# Altium project DIO_MCX_Isolated_mezzanine.PrjPCB
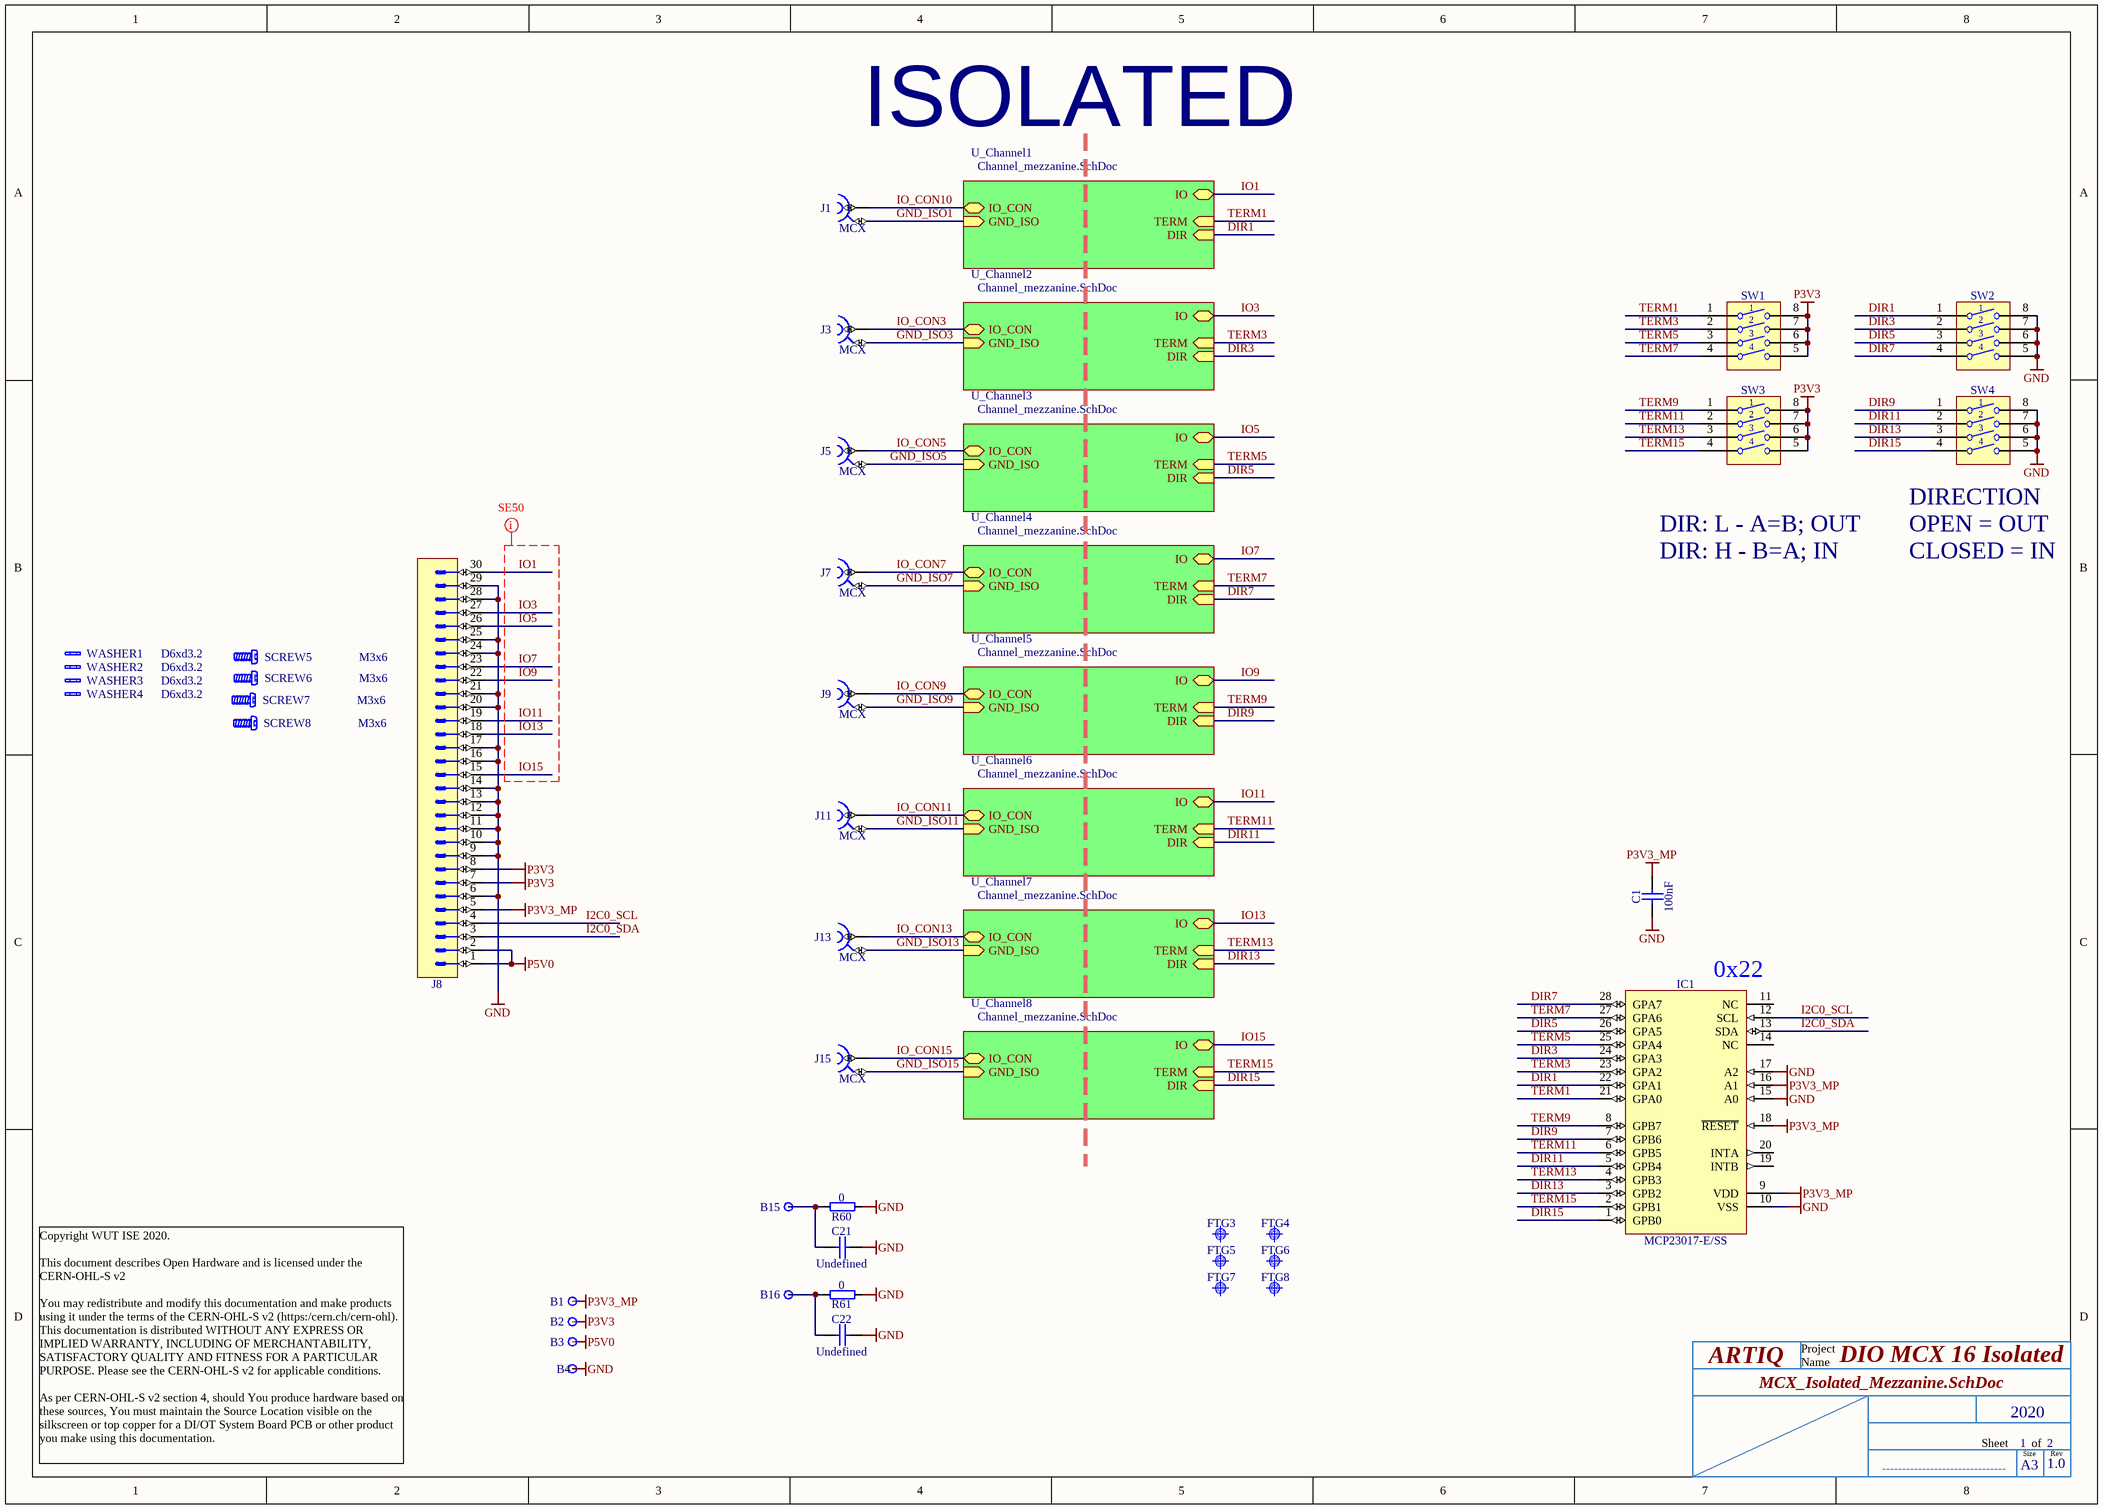
[diagram p0: MCX_Isolated_Mezzanine.SchDoc]
2 sheets, 239 parts. Net scope: hierarchical (ports join the sheet entries above them; power ports are global).
Board file: DIO_MCX_Isolated_mezzanine.PCBDOC
Sheets:
  MCX_Isolated_Mezzanine.SchDoc
    U_Channel1 = Channel_mezzanine.SchDoc
    U_Channel2 = Channel_mezzanine.SchDoc
    U_Channel3 = Channel_mezzanine.SchDoc
    U_Channel4 = Channel_mezzanine.SchDoc
    U_Channel5 = Channel_mezzanine.SchDoc
    U_Channel6 = Channel_mezzanine.SchDoc
    U_Channel7 = Channel_mezzanine.SchDoc
    U_Channel8 = Channel_mezzanine.SchDoc

## Sheet MCX_Isolated_Mezzanine.SchDoc: DIO MCX 16 Isolated
size A3; Author: F.Świtakowski; CompanyName: WUT ISE; DrawnBy: F.Świtakowski; Organization: WUT ISE; Address1: PW ISE; Address2: Nowowiejska 15/19 00-665 Warsaw; DocumentNumber: 1; Revision: 2; SheetNumber: 1; SheetTotal: 2; ModifiedBy: -; CheckedDate: -; Title2: Mezzanine; DivGrp: WUT ISE; Designer: F.Świtakowski; ModifiedDate: -; ProjectName: Sensor Box

### Parts
B1  Plated Hole  [c130h60]  (value not drawn)
B2  Plated Hole  [c130h60]  (value not drawn)
B3  Plated Hole  [c130h60]  (value not drawn)
B4  Plated Hole  [c130h60]  (value not drawn)
B15  Plated Hole  [MTG270_500]  (value not drawn)
B16  Plated Hole  [MTG270_500]  (value not drawn)
C1  100nF  [CAPC1005X55N]
C21  Undefined  [CAPC2012X135N]
C22  Undefined  [CAPC2012X135N]
FTG3  Use only in PCB  [FIDUCIAL_TOP_S100-200]  (value not drawn)
FTG4  Use only in PCB  [FIDUCIAL_TOP_C100-200]  (value not drawn)
FTG5  Use only in PCB  [FIDUCIAL_TOP_S100-200]  (value not drawn)
FTG6  Use only in PCB  [FIDUCIAL_TOP_C100-200]  (value not drawn)
FTG7  Use only in PCB  [FIDUCIAL_TOP_C100-200]  (value not drawn)
FTG8  Use only in PCB  [FIDUCIAL_TOP_S100-200]  (value not drawn)
IC1  MCP23017-E/SS  [SOP65P780X200-28N]
J1  MCX  [BEL_133-3701-801]
J3  MCX  [BEL_133-3701-801]
J5  MCX  [BEL_133-3701-801]
J7  MCX  [BEL_133-3701-801]
J8  AMPMODU  [TYCO_1-215307-5]  (value not drawn)
J9  MCX  [BEL_133-3701-801]
J11  MCX  [BEL_133-3701-801]
J13  MCX  [BEL_133-3701-801]
J15  MCX  [BEL_133-3701-801]
R60  0  [RESC1608X55N]
R61  0  [RESC1608X55N]
SCREW5  M3x6  [BOSSARD_BN5687-3061605_v]
SCREW6  M3x6  [BOSSARD_BN5687-3061605_v]
SCREW7  M3x6  [BOSSARD_BN5687-3061605_v]
SCREW8  M3x6  [BOSSARD_BN5687-3061605_v]
SW1  Switch  [SW_OMRON_A6S-4102-H]  (value not drawn)
SW2  Switch  [SW_OMRON_A6S-4102-H]  (value not drawn)
SW3  Switch  [SW_OMRON_A6S-4102-H]  (value not drawn)
SW4  Switch  [SW_OMRON_A6S-4102-H]  (value not drawn)
WASHER1  D6xd3.2  [BOSSARD_B3/6/0.3/BN1976_v]
WASHER2  D6xd3.2  [BOSSARD_B3/6/0.3/BN1976_v]
WASHER3  D6xd3.2  [BOSSARD_B3/6/0.3/BN1976_v]
WASHER4  D6xd3.2  [BOSSARD_B3/6/0.3/BN1976_v]

### Sub-sheets
U_Channel1 = Channel_mezzanine.SchDoc: IO (bidir), TERM (in), DIR (in), IO_CON (bidir), GND_ISO (in)
U_Channel2 = Channel_mezzanine.SchDoc: IO (bidir), TERM (in), DIR (in), IO_CON (bidir), GND_ISO (in)
U_Channel3 = Channel_mezzanine.SchDoc: IO (bidir), TERM (in), DIR (in), IO_CON (bidir), GND_ISO (in)
U_Channel4 = Channel_mezzanine.SchDoc: IO (bidir), TERM (in), DIR (in), IO_CON (bidir), GND_ISO (in)
U_Channel5 = Channel_mezzanine.SchDoc: IO (bidir), TERM (in), DIR (in), IO_CON (bidir), GND_ISO (in)
U_Channel6 = Channel_mezzanine.SchDoc: IO (bidir), TERM (in), DIR (in), IO_CON (bidir), GND_ISO (in)
U_Channel7 = Channel_mezzanine.SchDoc: IO (bidir), TERM (in), DIR (in), IO_CON (bidir), GND_ISO (in)
U_Channel8 = Channel_mezzanine.SchDoc: IO (bidir), TERM (in), DIR (in), IO_CON (bidir), GND_ISO (in)

### Nets
GND: B4.1 C1.1 C21.2 C22.2 IC1.10(VSS) IC1.15(A0) IC1.17(A2) J8.6 J8.9 J8.10 J8.11 J8.12 J8.13 J8.14 J8.16 J8.17 J8.20 J8.21 J8.24 J8.25 J8.28 J8.29 R60.1 R61.1 SW2.5 SW2.6 SW2.7 SW2.8 SW4.5 SW4.6 SW4.7 SW4.8
P3V3: B2.1 J8.7 J8.8 SW1.5 SW1.6 SW1.7 SW1.8 SW3.5 SW3.6 SW3.7 SW3.8
P3V3_MP: B1.1 C1.2 IC1.9(VDD) IC1.16(A1) IC1.18(~{RESET}) J8.5
P5V0: B3.1 J8.1 J8.2
DIR1: IC1.22(GPA1) SW2.1 ; sheet U_Channel1/DIR  [project net DIR]
DIR3: IC1.24(GPA3) SW2.2 ; sheet U_Channel2/DIR  [project net DIR]
DIR5: IC1.26(GPA5) SW2.3 ; sheet U_Channel3/DIR  [project net DIR]
DIR7: IC1.28(GPA7) SW2.4 ; sheet U_Channel4/DIR  [project net DIR]
DIR9: IC1.7(GPB6) SW4.1 ; sheet U_Channel5/DIR  [project net DIR]
DIR11: IC1.5(GPB4) SW4.2 ; sheet U_Channel6/DIR  [project net DIR]
DIR13: IC1.3(GPB2) SW4.3 ; sheet U_Channel7/DIR  [project net DIR]
DIR15: IC1.1(GPB0) SW4.4 ; sheet U_Channel8/DIR  [project net DIR]
GND_ISO1: J1.2 ; sheet U_Channel1/GND_ISO  [project net GND_ISO]
GND_ISO3: J3.2 ; sheet U_Channel2/GND_ISO  [project net GND_ISO]
GND_ISO5: J5.2 ; sheet U_Channel3/GND_ISO  [project net GND_ISO]
GND_ISO7: J7.2 ; sheet U_Channel4/GND_ISO  [project net GND_ISO]
GND_ISO9: J9.2 ; sheet U_Channel5/GND_ISO  [project net GND_ISO]
GND_ISO11: J11.2 ; sheet U_Channel6/GND_ISO  [project net GND_ISO]
GND_ISO13: J13.2 ; sheet U_Channel7/GND_ISO  [project net GND_ISO]
GND_ISO15: J15.2 ; sheet U_Channel8/GND_ISO  [project net GND_ISO]
I2C0_SCL: IC1.12(SCL) J8.4
I2C0_SDA: IC1.13(SDA) J8.3
IO1: J8.30 ; sheet U_Channel1/IO  [project net IO]
IO3: J8.27 ; sheet U_Channel2/IO  [project net IO]
IO5: J8.26 ; sheet U_Channel3/IO  [project net IO]
IO7: J8.23 ; sheet U_Channel4/IO  [project net IO]
IO9: J8.22 ; sheet U_Channel5/IO  [project net IO]
IO11: J8.19 ; sheet U_Channel6/IO  [project net IO]
IO13: J8.18 ; sheet U_Channel7/IO  [project net IO]
IO15: J8.15 ; sheet U_Channel8/IO  [project net IO]
IO_CON3: J3.1 ; sheet U_Channel2/IO_CON  [project net IO_CON]
IO_CON5: J5.1 ; sheet U_Channel3/IO_CON  [project net IO_CON]
IO_CON7: J7.1 ; sheet U_Channel4/IO_CON  [project net IO_CON]
IO_CON9: J9.1 ; sheet U_Channel5/IO_CON  [project net IO_CON]
IO_CON10: J1.1 ; sheet U_Channel1/IO_CON  [project net IO_CON]
IO_CON11: J11.1 ; sheet U_Channel6/IO_CON  [project net IO_CON]
IO_CON13: J13.1 ; sheet U_Channel7/IO_CON  [project net IO_CON]
IO_CON15: J15.1 ; sheet U_Channel8/IO_CON  [project net IO_CON]
TERM1: IC1.21(GPA0) SW1.1 ; sheet U_Channel1/TERM  [project net TERM]
TERM3: IC1.23(GPA2) SW1.2 ; sheet U_Channel2/TERM  [project net TERM]
TERM5: IC1.25(GPA4) SW1.3 ; sheet U_Channel3/TERM  [project net TERM]
TERM7: IC1.27(GPA6) SW1.4 ; sheet U_Channel4/TERM  [project net TERM]
TERM9: IC1.8(GPB7) SW3.1 ; sheet U_Channel5/TERM  [project net TERM]
TERM11: IC1.6(GPB5) SW3.2 ; sheet U_Channel6/TERM  [project net TERM]
TERM13: IC1.4(GPB3) SW3.3 ; sheet U_Channel7/TERM  [project net TERM]
TERM15: IC1.2(GPB1) SW3.4 ; sheet U_Channel8/TERM  [project net TERM]
NetB15_1: B15.1 C21.1 R60.2
NetB16_1: B16.1 C22.1 R61.2

Not connected (* = marked no-connect by the designer): IC1 11(NC) 14(NC) 19(INTB) 20(INTA)

### Layout directives
net class SE50; rule Width Constraint [Pref Width = 0.35mm    Min Width = 0.3mm    Max Width = 0.35mm]: IO1, IO3, IO5, IO7, IO9, IO11, IO13, IO15

### Notes on the sheet
- ISOLATED
- (near SW4) DIRECTION
- DIR: L - A=B; OUT
- DIR: H - B=A; IN
- OPEN = OUT
- CLOSED = IN
- (near IC1) 0x22
- ARTIQ
- Project
- Name
- Copyright WUT ISE 2020.
  This document describes Open Hardware and is licensed under the CERN-OHL-S v2
  You may redistribute and modify this documentation and make products using it under the terms of the CERN-OHL-S v2 (https:/cern.ch/cern-ohl). This documentation is distributed WITHOUT ANY EXPRESS OR IMPLIED WARRANTY, INCLUDING OF MERCHANTABILITY, SATISFACTORY QUALITY AND FITNESS FOR A PARTICULAR PURPOSE. Please see the CERN-OHL-S v2 for applicable conditions.
  As per CERN-OHL-S v2 section 4, should You produce hardware based on these sources, You must maintain the Source Location visible on the silkscreen or top copper for a DI/OT System Board PCB or other product you make using this documentation.
- Sheet
- 2020
- Size
- A3
- of
- Rev
- -------------------------------
- 1.0

### Library data of the parts
B1-B4 = PLATED_HOLE0.6_PAD1.3: Single Terminal Socket; Part Description: Plated Through Hole: Hole Dia.=0.6mm Pad Dia.=1.3mm; Mounted: No; Part Number: PLATED_HOLE0.6_PAD1.3; Component Kind: Standard (No BOM); Component Type: Standard (No BOM); Pin Count: 1; Family: Plated Hole; Socket: No; SMD: No; Sense: No; Status: None; ComponentHeight: 0mm; HelpURL: Undefined; Author: CERN DEM MR; CreateDate: 02.03.2016; LatestRevisionDate: 02.03.2016; PackageDescription: Plated Through Hole: Hole Dia.=0.6mm Pad Dia.=1.3mm
B15 B16 = PLATED_HOLE2.7_PAD5.0: Single Terminal Socket; Part Description: Plated Through Hole: Hole Dia.=2.7mm Pad Dia.=5.0mm; Mounted: No; Part Number: PLATED_HOLE2.7_PAD5.0; Component Kind: Standard (No BOM); Component Type: Standard (No BOM); Pin Count: 1; Family: Plated Hole; Socket: No; SMD: No; Sense: No; Status: None; ComponentHeight: 0mm; HelpURL: Undefined; Author: CERN DEM JMW; CreateDate: 27.09.2011; LatestRevisionDate: 27.09.2011; PackageDescription: Plated Through Hole: Hole Dia.=2.7mm Pad Dia.=5.0mm
C1 = CC0402_100NF_50V_10%_X7R: Non-polarised capacitor; Part Description: SMD Multilayer Chip Ceramic Capacitor; Manufacturer: GENERIC; Manufacturer1 Part Number: GRM155R71H104KE14D; Voltage: 50V; TC: X7R; Tolerance: ±10%; Part Number: CC0402_100NF_50V_10%_X7R; Component Kind: Standard; Component Type: Standard; Pin Count: 2; Value: 100nF; Status: None; Manufacturer Part Number: CC0402_100NF_50V_10%_X7R; Case: 0402; Mounted: Yes; Socket: No; SMD: Yes; Sense: No; Manufacturer1 Example: MURATA; Manufacturer1 ComponentHeight: 0.55mm; HelpURL: \\cern.ch\dfs\Applications\Altium\Datasheets\CC0402_MURATA_GRM155R71H104KE14D.pdf; Author: CERN DEM MR; CreateDate: 30.06.2017; LatestRevisionDate: 30.06.2017
C21 C22 = CC0805_NO-VALUE: Non-polarised capacitor; Part Description: Reserved Footprint For 0805(2012) Chip Ceramic Capacitor; Mounted: No; Part Number: CC0805_NO-VALUE; Component Kind: Standard; Component Type: Standard; Pin Count: 2; Value: Undefined; Status: None; Manufacturer: Undefined; Manufacturer Part Number: CC0805_NO-VALUE; Case: 0805; Socket: No; SMD: Yes; Sense: No; Manufacturer1 ComponentHeight: 1.35mm; HelpURL: Undefined; Author: CERN DEM JLC; CreateDate: 10.12.2008; LatestRevisionDate: 11.09.2013
FTG3 FTG5 FTG8 = FIDUCIAL_TARGET_S100-200: Fiducial Target; Part Description: Square Fiducial Target, Top Layer, 1.0mm, Top Solder 2.0mm, Keepout =2.0mm; Mounted: No; Part Number: FIDUCIAL_TARGET_S100-200; Component Kind: Standard (No BOM); Component Type: Standard (No BOM); Pin Count: 1; Family: Fiducial; Socket: No; SMD: Yes; Sense: No; Status: None; ComponentHeight: 0mm; HelpURL: Undefined; Author: CERN DEM JLC; CreateDate: 09.02.2010; LatestRevisionDate: 04.04.2012; PackageDescription: Square Fiducial Target, Top Layer, 1.0mm, Top Solder 2.0mm, Keepout =2.0mm
FTG4 FTG6 FTG7 = FIDUCIAL_TARGET_C100-200: Fiducial Target; Part Description: Round Fiducial Target, Top Layer, 1.0mm, Top Solder 2.0mm, Keepout =2.0mm; Mounted: No; Part Number: FIDUCIAL_TARGET_C100-200; Component Kind: Standard (No BOM); Component Type: Standard (No BOM); Pin Count: 1; Family: Fiducial; Socket: No; SMD: Yes; Sense: No; Status: None; ComponentHeight: 0mm; HelpURL: Undefined; Author: CERN DEM JLC; CreateDate: 09.02.2010; LatestRevisionDate: 04.04.2012; PackageDescription: Round Fiducial Target, Top Layer, 1.0mm, Top Solder 2.0mm, Keepout =2.0mm
IC1 = MCP23017-E/SS: 16-bit I/O Port Expander With Serial Interface; Manufacturer: MICROCHIP TECHNOLOGY; PressFit: No; Bonding: No; Part Number: MCP23017-E/SS; Component Kind: Standard; Component Type: Standard; Device: MCP23017-E/SS; PackageDescription: SOP, 0.65mm Pitch; 28 pin, 5.30mm W X 10.20mm L X 2.00mm H body, IPC Medium Density; Part Description: 16-bit I/O Port Expander With Serial Interface; Manufacturer Part Number: MCP23017-E/SS; Pin Count: 28; Case: SSOP28; Mounted: Yes; Socket: No; SMD: Yes; Sense: No; ComponentHeight: 2mm; Author: CERN DEM JLC; HelpURL: \\cern.ch\dfs\Applications\Altium\Datasheets\MCP23017-E-SS.pdf; CreateDate: 17/01/2011; LatestRevisionDate: 17/01/2011
J1 J3 J5 J7 J9 J11 J13 J15 = BELFUSE_133-3701-801: Part Description: MCX Jack, End Launch Straight Receptacle - Tab Contact, For 1.6mm Thickness Board; Manufacturer: BEL; PressFit: No; Part Number: BELFUSE_133-3701-801; Component Kind: Standard; Component Type: Standard; Pin Count: 2; Family: MCX; Mounted: Yes; Socket: No; SMD: No; Sense: No; Status: None; Manufacturer Part Number: 133-3701-801; ComponentHeight: 3.53mm; HelpURL: \\cern.ch\dfs\Applications\Altium\Datasheets\BEL_133-3701-801.pdf; Author: CERN DEM MR; CreateDate: 21.10.2019; LatestRevisionDate: 21.10.2019
J8 = CON_2x15_2.54_female_V_mirror: Connector 2.54mm, 30 pin female, vertical, 7mm, AMPMODU HV-100/HV-190; Part Description: 34 Contacts, Dual Row Vertical Low Profile IDC Shrouded Header, with Long Eject Latch; Manufacturer: TYCO ELECTRONICS; Manufacturer Part Number: 1-215307-5; PressFit: No; Part Number: TYCO_1-215307-5; Component Kind: Standard; Component Type: Standard; Pin Count: 30; Family: AMPMODU; Mounted: Yes; Socket: No; SMD: No; Sense: No; Status: None; ComponentHeight: 22.86mm; HelpURL: \\cern.ch\dfs\Applications\Altium\Datasheets\TYCO_3-1761606-1.pdf; Author: GK; CreateDate: 05.10.2015; LatestRevisionDate: 05.10.2015
R60 R61 = R0603_0R_JUMPER: Resistor; Part Description: 1A (0.05R Max DC Resistance) Zero Ohm Jumper; Manufacturer: GENERIC; Manufacturer1 Part Number: NRC06Z0; PressFit: No; Part Number: R0603_0R_JUMPER; Component Kind: Standard; Component Type: Standard; Pin Count: 2; Value: 0; Status: Preferred; Manufacturer Part Number: R0603_0R_JUMPER; Case: 0603; Mounted: Yes; Sense: No; Socket: No; SMD: Yes; Manufacturer1 Example: NIC COMPONENT; Manufacturer1 ComponentHeight: 0.55mm; HelpURL: \\cern.ch\dfs\Applications\Altium\Datasheets\R0603_NIC_NRC.pdf; Author: CERN DEM JLC; CreateDate: 03.12.2007; LatestRevisionDate: 13.03.2008
SCREW5-SCREW8 = BOSSARD_BN5687-3061605_v: Screw; Part Description: M3 L=6mm Hexalobular Socket Pan Head Screw, Fully Threaded, Stainless Steel A2; Manufacturer Part Number: BN5687 Art.3061605; PressFit: No; Part Number: BOSSARD_BN5687-3061605_v; Component Kind: Standard; Component Type: Mechanical; Pin Count: 0; PackageDescription: M3 L=6mm Hexalobular Socket Pan Head Screw, Fully Threaded - Stainless Steel A2; Mounted: Yes; Socket: No; SMD: No; Sense: No; Status: None; Value: M3x6; Manufacturer: BOSSARD; ComponentHeight: 2.4mm; HelpURL: \\cern.ch\dfs\Applications\Altium\Datasheets\BOSSARD_BN5687-3061605.pdf; Author: CERN DEM JLC; CreateDate: 15.01.2013; LatestRevisionDate: 15.01.2013
SW1-SW4 = SW_OMRON_A6S-4102-H: 4 Ways SPST DIP Switch; Part Description: 4 Ways SPST DIP Switch, White Flat Actuator with Seal Tape, Contact Rating 25mA 24VDC; Manufacturer: OMRON; PressFit: No; Part Number: SW_OMRON_A6S-4102-H; Component Kind: Standard; Component Type: Standard; Pin Count: 8; PackageDescription: Pitch 2.54mm, Body 11.3x6.4mm, 4 Ways SPST Surface-Mounting DIP Switch, OMRON A6S-H; Family: Switch; Mounted: Yes; Socket: No; SMD: Yes; Sense: No; Status: None; Manufacturer Part Number: A6S-4102-H; ComponentHeight: 3.8mm; HelpURL: \\cern.ch\dfs\Applications\Altium\Datasheets\SW_OMRON_A6S-4102-H.pdf; Author: CERN DEM JMW; CreateDate: 25.09.2008; LatestRevisionDate: 25.09.2008
WASHER1-WASHER4 = MECH_Washer_M3x0.3x6: Washer, M3x0.3x6; Part Number: BOSSARD_B3/6/0.3/BN1976; Part Description: Flat Washer without Chamfer for M3 Screw, Steel; Manufacturer: BOSSARD; Manufacturer Part Number: B3/6/0.3/BN1976; PressFit: No; Component Kind: Standard; Component Type: Mechanical; Pin Count: 0; PackageDescription: Flat Washer without Chamfer for M3 Screw, steel; Mounted: Yes; Socket: No; SMD: No; Sense: No; Status: None; Value: D6xd3.2; ComponentHeight: 0.5mm; HelpURL: \\cern.ch\dfs\Applications\Altium\Datasheets\BOSSARD_BN1074-1404830.pdf; Author: GK; CreateDate: 08.03.2018; LatestRevisionDate: 08.03.2018

## Sheet Channel_mezzanine.SchDoc: DIO MCX 16 Isolated
size A4; DocumentNumber: 2; SheetNumber: 2; SheetTotal: 2
Used 8 times, as channels U_Channel1, U_Channel2, U_Channel3, U_Channel4, U_Channel5, U_Channel6, U_Channel7, U_Channel8. Parts and nets are listed once, with the designators drawn on the sheet.
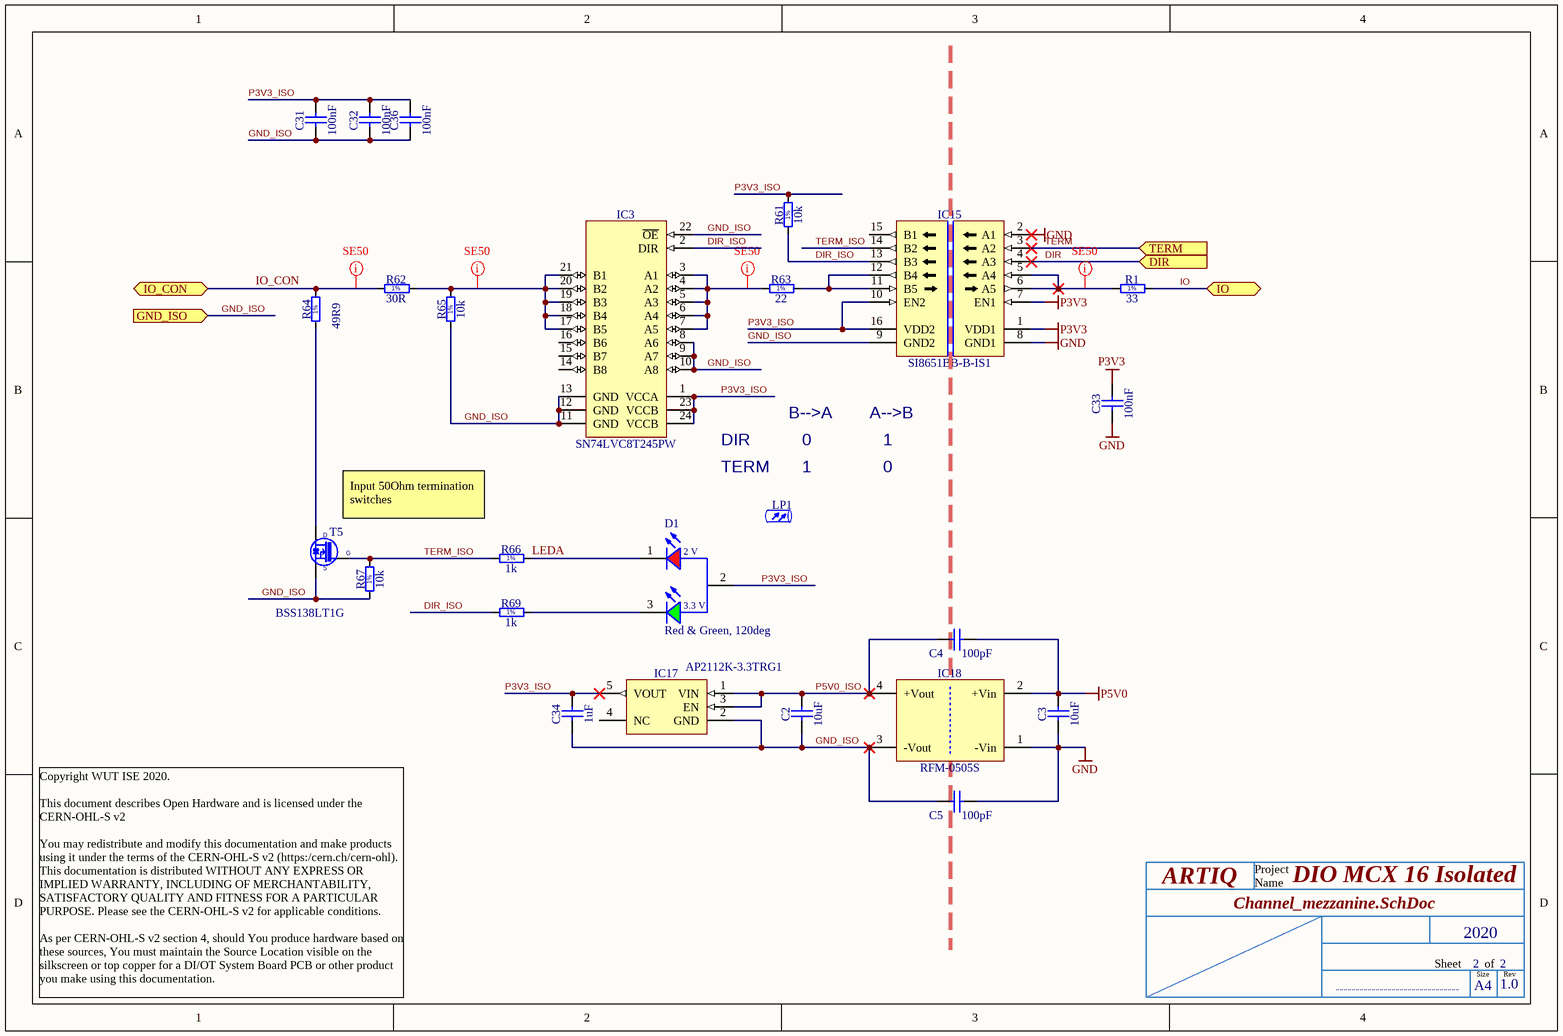
[diagram p1: Channel_mezzanine.SchDoc]

### Parts
C2  10uF  [CAPC1608X80N]
C3  10uF  [CAPC1608X80N]
C4  100pF  [CAPC3216X180N]
C5  100pF  [CAPC3216X180N]
C31  100nF  [CAPC1005X55N]
C32  100nF  [CAPC1005X55N]
C33  100nF  [CAPC1005X55N]
C34  1uF  [CAPC1005X55N]
C36  100nF  [CAPC1005X55N]
D1  Red & Green, 120deg  [WL-SBSW_1204]
IC3  SN74LVC8T245PW  [SOP65P640X120-24N]
IC15  SI8651BB-B-IS1  [SOIC127P600X175-16N]
IC17  AP2112K-3.3TRG1  [SOT95P285X140-5N]
IC18  RFM-0505S  [DCDC_RECOM_RFM]
LP1  (no value)  [FIX&FASTEN-LEMB2-8V0-F]  (no BOM)
R1  33  [RESC1005X40N]
R61  10k  [RESC1005X40N]
R62  30R  [RESC3225X70N]
R63  22  [RESC1005X40N]
R64  49R9  [RESC3225X70N]
R65  10k  [RESC1005X40N]
R66  1k  [RESC1005X40N]
R67  10k  [RESC1005X40N]
R69  1k  [RESC1005X40N]
T5  BSS138LT1G  [SOT95P240X110-3N]

### Ports
DIR (in), GND_ISO (in), IO (bidir), IO_CON (bidir), TERM (in)

### Nets
GND: C3.1 C5.2 C33.1 IC15.2(A1) IC15.8(GND1) IC18.1(-Vin)
P3V3: C33.2 IC15.1(VDD1) IC15.7(EN1)
P5V0: C3.2 C4.2 IC18.2(+Vin)
DIR: IC15.4(A3) ; port DIR
DIR_ISO: IC3.2(DIR) IC15.13(B3) R61.1 R69.1
GND_ISO: C2.1 C5.1 C31.1 C32.1 C34.1 C36.1 IC3.8(A6) IC3.9(A7) IC3.10(A8) IC3.11(GND) IC3.12(GND) IC3.13(GND) IC3.22(~{OE}) IC15.9(GND2) IC17.2(GND) IC18.3(-Vout) R65.1 R67.1 T5.2(S) ; port GND_ISO
IO: R1.2 ; port IO
IO_CON: R62.1 R64.2 ; port IO_CON
LEDA: D1.1(K) R66.2
P3V3_ISO: C31.2 C32.2 C34.2 C36.2 D1.2(A) IC3.1(VCCA) IC3.23(VCCB) IC3.24(VCCB) IC15.10(EN2) IC15.16(VDD2) IC17.5(VOUT) R61.2
P5V0_ISO: C2.2 C4.1 IC17.1(VIN) IC17.3(EN) IC18.4(+Vout)
TERM: IC15.3(A2) ; port TERM
TERM_ISO: IC15.14(B2) R66.1 R67.2 T5.1(G)
NetD1_3: D1.3(K) R69.2
NetIC3_3: IC3.3(A1) IC3.4(A2) IC3.5(A3) IC3.6(A4) IC3.7(A5) R63.1
NetIC3_17: IC3.17(B5) IC3.18(B4) IC3.19(B3) IC3.20(B2) IC3.21(B1) R62.2 R65.2
NetIC15_5: IC15.5(A4) IC15.6(A5) R1.1
NetIC15_11: IC15.11(B5) IC15.12(B4) R63.2
NetR64_1: R64.1 T5.3(D)

Not connected (* = marked no-connect by the designer): IC3 14(B8) 15(B7) 16(B6); IC15 15(B1); IC17 4(NC)

### Channels
U_Channel1: designators end in A; ports DIR=DIR GND_ISO=GND_ISO IO=IO IO_CON=IO_CON TERM=TERM
U_Channel2: designators end in B; ports DIR=DIR GND_ISO=GND_ISO IO=IO IO_CON=IO_CON TERM=TERM
U_Channel3: designators end in C; ports DIR=DIR GND_ISO=GND_ISO IO=IO IO_CON=IO_CON TERM=TERM
U_Channel4: designators end in D; ports DIR=DIR GND_ISO=GND_ISO IO=IO IO_CON=IO_CON TERM=TERM
U_Channel5: designators end in E; ports DIR=DIR GND_ISO=GND_ISO IO=IO IO_CON=IO_CON TERM=TERM
U_Channel6: designators end in F; ports DIR=DIR GND_ISO=GND_ISO IO=IO IO_CON=IO_CON TERM=TERM
U_Channel7: designators end in G; ports DIR=DIR GND_ISO=GND_ISO IO=IO IO_CON=IO_CON TERM=TERM
U_Channel8: designators end in H; ports DIR=DIR GND_ISO=GND_ISO IO=IO IO_CON=IO_CON TERM=TERM

### Layout directives
net class SE50; rule Width Constraint [Pref Width = 0.35mm    Min Width = 0.3mm    Max Width = 0.35mm]: IO_CON, NetIC3A_3, NetIC3A_17, NetIC15A_5

### Notes on the sheet
- DIR
- B-->A
- 0
- A-->B
- 1
- (near T5) Input 50Ohm termination switches
- TERM
- ARTIQ
- Project
- Name
- Sheet
- 2020
- Size
- A4
- of
- 1.0
- Rev
- Copyright WUT ISE 2020.
  This document describes Open Hardware and is licensed under the CERN-OHL-S v2
  You may redistribute and modify this documentation and make products using it under the terms of the CERN-OHL-S v2 (https:/cern.ch/cern-ohl). This documentation is distributed WITHOUT ANY EXPRESS OR IMPLIED WARRANTY, INCLUDING OF MERCHANTABILITY, SATISFACTORY QUALITY AND FITNESS FOR A PARTICULAR PURPOSE. Please see the CERN-OHL-S v2 for applicable conditions.
  As per CERN-OHL-S v2 section 4, should You produce hardware based on these sources, You must maintain the Source Location visible on the silkscreen or top copper for a DI/OT System Board PCB or other product you make using this documentation.
- -------------------------------
- (in symbol 155124RG73200) 2 V; 3.3 V
- (in symbol R0402_1K_1%_0.0625W_100PPM) 1%
- (in symbol R0402_10K_1%_0.0625W_100PPM) 1%
- (in symbol R0402_22R_1%_0.0625W_100PPM) 1%
- (in symbol R0402_33R_1%_0.0625W_100PPM) 1%
- (in symbol R1210_30R_5%_0.5W_200PPM) 1%
- (in symbol R1210_49R9_1%_0.5W_100PPM_VISHAY_CRCW) 1%

### Library data of the parts
C2 C3 = CC0603_10UF_16V_20%_X5R: Non-polarised capacitor; Part Description: SMD Multilayer Chip Ceramic Capacitor; Manufacturer: GENERIC; Manufacturer1 Part Number: GRM188R61C106MA73D; Voltage: 16V; TC: X5R; Tolerance: ±20%; Part Number: CC0603_10UF_16V_20%_X5R; Component Kind: Standard; Component Type: Standard; Pin Count: 2; Value: 10uF; Status: None; Manufacturer Part Number: CC0603_10UF_16V_20%_X5R; Case: 0603; Mounted: Yes; Socket: No; SMD: Yes; Sense: No; Manufacturer1 Example: MURATA; Manufacturer1 ComponentHeight: 0.8mm; HelpURL: \\cern.ch\dfs\Applications\Altium\Datasheets\CC0603_X5R_MURATA_GRM.pdf; Author: CERN DEM MR; CreateDate: 02.03.2016; LatestRevisionDate: 02.03.2016
C4 C5 = CC1206_100PF_2KV_5%_C0G: Non-polarised capacitor; Part Description: High Voltage MLC Chip Capacitor; Manufacturer: GENERIC; Manufacturer1 Part Number: 1206GA101JAT2A; Voltage: 2kV; TC: C0G/NP0; Tolerance: ±5%; Part Number: CC1206_100PF_2KV_5%_C0G; Component Kind: Standard; Component Type: Standard; Pin Count: 2; Value: 100pF; Status: None; Manufacturer Part Number: CC1206_100PF_2KV_5%_C0G; Case: 1206; Mounted: Yes; Socket: No; SMD: Yes; Sense: No; Manufacturer1 Example: AVX; Manufacturer1 ComponentHeight: 1.8mm; HelpURL: \\cern.ch\dfs\Applications\Altium\Datasheets\CC1206_C0G_AVX_HV-MLC.pdf; Author: CERN DEM JLC; CreateDate: 17.05.2017; LatestRevisionDate: 17.05.2017
C31-C33 C36 = CC0402_100NF_50V_10%_X7R: as C1 on sheet MCX_Isolated_Mezzanine; Part Number: CC0402_100NF_50V_10%_X7R; Component Kind: Standard; Component Type: Standard; Pin Count: 2; Value: 100nF; Status: None; Manufacturer Part Number: CC0402_100NF_50V_10%_X7R; Case: 0402; Mounted: Yes; Socket: No; SMD: Yes; Sense: No; Manufacturer1 Example: MURATA; Manufacturer1 ComponentHeight: 0.55mm; HelpURL: \\cern.ch\dfs\Applications\Altium\Datasheets\CC0402_MURATA_GRM155R71H104KE14D.pdf; Author: CERN DEM MR; CreateDate: 30.06.2017; LatestRevisionDate: 30.06.2017
C34 = CC0402_1UF_16V_10%_X5R: Non-polarised capacitor; Part Description: SMD Multilayer Chip Ceramic Capacitor; Manufacturer: GENERIC; Manufacturer1 Part Number: C1005X5R1C105KT; Voltage: 16V; TC: X5R; Tolerance: ±10%; Part Number: CC0402_1UF_16V_10%_X5R; Component Kind: Standard; Component Type: Standard; Pin Count: 2; Value: 1uF; Status: Preferred; Manufacturer Part Number: CC0402_1UF_16V_10%_X5R; Case: 0402; Mounted: Yes; Socket: No; SMD: Yes; Sense: No; Manufacturer1 Example: TDK; Manufacturer1 ComponentHeight: 0.55mm; HelpURL: \\cern.ch\dfs\Applications\Altium\Datasheets\CC0402_X5R_TDK_C.pdf; Author: CERN DEM JLC; CreateDate: 25.10.2012; LatestRevisionDate: 25.10.2012
D1 = 155124RG73200: WL-SBSW SMT Bi-color Side View Waterclear, size 1204, Red & Green, 120deg; Luminous Intensity: 160mcd@Green, 60mcd@Red; Dominant Wavelength: 525nm@Green, 624nm@Red; Forward Voltage: 3.3V@Green, 2V@Red; Peak Wavelength: 520nm@Green, 632nm@Red; Chip Technology: AlInGaP + InGaN; ComponentLink1Description: Manufacturer; ComponentLink1URL: http://www.we-online.de; ComponentLink2Description: Datasheet; ComponentLink2URL: https://katalog.we-online.de/led/datasheet/155124RG73200.pdf; Emitting Color: Red & Green; Operating Temperature: -40 to +85degC; Mounting Technology: SMT; Part Number: 155124RG73200; Packaging: Tape and Reel; Published Date: October 2019; Publisher: Wurth Elektronik; Size: 1204; Viewing Angle: 120deg
IC3 = SN74LVC8T245PW: 8-Bit Dual-Supply Bus Transceiver With Configurable Voltage Translation and 3-State Outputs; Manufacturer: TEXAS INSTRUMENTS; PressFit: No; Bonding: No; Part Number: SN74LVC8T245PW; Component Kind: Standard; Component Type: Standard; Device: SN74LVC8T245PW; PackageDescription: SOP, 0.65mm Pitch; 24 Pin, 4.40mm W X 7.80mm L X 1.20mm H Body, IPC Medium Density; Part Description: 8-Bit Dual-Supply Bus Transceiver With Configurable Voltage Translation and 3-State Outputs; Manufacturer Part Number: SN74LVC8T245PW; Pin Count: 24; Case: TSSOP24; Mounted: Yes; Socket: No; SMD: Yes; Sense: No; ComponentHeight: 1.2mm; Author: CERN DEM JLC; HelpURL: \\cern.ch\dfs\Applications\Altium\Datasheets\SN74LVC8T245PW.pdf; CreateDate: 02.09.2009; LatestRevisionDate: 02.09.2009
IC15 = SI8651BB-B-IS1: Low Power Five-Channel Digital Isolator; Part Description: 2.5kV 150Mbps Low Power Five-Channel Digital Isolator; Manufacturer: SILICON LABS; PressFit: No; Bonding: No; Part Number: SI8651BB-B-IS1; Component Kind: Standard; Component Type: Standard; Device: SI8651BB-B-IS1; PackageDescription: SOIC 16, Pitch 1.27mm - Body 4x10mm, IPC Medium Density; Manufacturer Part Number: SI8651BB-B-IS1; Pin Count: 16; Case: SOIC16; Mounted: Yes; Socket: No; SMD: Yes; Sense: No; ComponentHeight: 1.75mm; Author: CERN DEM JLC; HelpURL: \\cern.ch\dfs\Applications\Altium\Datasheets\SI8651BB-B-IS1.pdf; CreateDate: 31.10.2013; LatestRevisionDate: 31.10.2013
IC17 = AP2112K-3.3TRG1: 600mA CMOS Low Dropout Linear Regulator with Enable; Part Description: 3.3V 600mA CMOS Low Dropout Linear Regulator with Enable; Manufacturer: DIODES INCORPORATED; PressFit: No; Bonding: No; Part Number: AP2112K-3.3TRG1; Component Kind: Standard; Component Type: Standard; Device: AP2112K-3.3TRG1; PackageDescription: SOT23, 0.95mm Pitch; 5 Pin, 1.6mm W X 3.0mm L X 1.40mm H body, IPC Medium Density; Manufacturer Part Number: AP2112K-3.3TRG1; Pin Count: 5; Case: SOT25; Mounted: Yes; Socket: No; SMD: Yes; Sense: No; ComponentHeight: 1.4mm; HelpURL: \\cern.ch\dfs\Applications\Altium\Datasheets\AP2112K-3.3TRG1.pdf; Author: CERN DEM MR; CreateDate: 13.12.2017; LatestRevisionDate: 13.12.2017
IC18 = RFM-0505S: RECOM, RFM Serie, Single Output DCDC Converter; Part Description: 5V ±10% to 5V, Iout (max) 200mA, 1W DC-DC Converter; PressFit: No; Bonding: No; Part Number: RFM-0505S; Component Kind: Standard; Component Type: Standard; Device: RFM-0505S; PackageDescription: RFM Series, Body 11.5 x 6.00mm, SIP-4 Package; Manufacturer: RECOM; Manufacturer Part Number: RFM-0505S; Pin Count: 4; Mounted: Yes; Socket: No; SMD: No; Sense: No; ComponentHeight: 10.5mm; HelpURL: \\cern.ch\dfs\Applications\Altium\Datasheets\RFM-0505S.pdf; Author: CERN DEM BC; CreateDate: 16.07.2020; LatestRevisionDate: 16.07.2020
LP1 = LED Light_pipe_2.3x8mm: Part Description: Right Angle Single Element 2.3x8mm Round Lightpipe; Manufacturer: FIX&FASTEN; Manufacturer Part Number: FIX-LEMB2-8V0-F; PressFit: No; Bonding: No; Part Number: FIX&FASTEN-LEMB2-8V0-F; Component Type: Standard; PackageDescription: Right Angle Single Element 2.3mmx8mm Round Lightpipe; Pin Count: 0; Mounted: Yes; Socket: No; SMD: No; Sense: No; ComponentHeight: 2.3mm; HelpURL: \\cern.ch\dfs\Applications\Altium\Datasheets\LEDLP_DIALIGHT_515-1049F.pdf; Author: GK; CreateDate: 24.01.2017; LatestRevisionDate: 24.01.2017
R1 = R0402_33R_1%_0.0625W_100PPM: Resistor - 1%; Part Description: General Purpose Thick Film Chip Resistor; Manufacturer: GENERIC; Manufacturer1 Part Number: 232270673309L; TC: ±100ppm/°C; PressFit: No; Part Number: R0402_33R_1%_0.0625W_100PPM; Component Kind: Standard; Component Type: Standard; Pin Count: 2; Value: 33; Status: Not Recommended; Power: 0.0625W; Tolerance: ±1%; Manufacturer Part Number: R0402_33R_1%_0.0625W_100PPM; Case: 0402; Mounted: Yes; Sense: No; Socket: No; SMD: Yes; Manufacturer1 Example: YAGEO PHYCOMP; Manufacturer1 ComponentHeight: 0.4mm; HelpURL: \\cern.ch\dfs\Applications\Altium\Datasheets\R0402_Phycomp_RC0402.pdf; Author: CERN DEM JLC; CreateDate: 03.12.2007; LatestRevisionDate: 17.10.2012
R61 R67 = R0402_10K_1%_0.0625W_100PPM: Resistor - 1%; Part Description: General Purpose Thick Film Chip Resistor; Manufacturer: GENERIC; Manufacturer1 Part Number: 232270671003L; TC: ±100ppm/°C; PressFit: No; Part Number: R0402_10K_1%_0.0625W_100PPM; Component Kind: Standard; Component Type: Standard; Pin Count: 2; Value: 10k; Status: Not Recommended; Power: 0.0625W; Tolerance: ±1%; Manufacturer Part Number: R0402_10K_1%_0.0625W_100PPM; Case: 0402; Mounted: Yes; Sense: No; Socket: No; SMD: Yes; Manufacturer1 Example: YAGEO PHYCOMP; Manufacturer1 ComponentHeight: 0.4mm; HelpURL: \\cern.ch\dfs\Applications\Altium\Datasheets\R0402_Phycomp_RC0402.pdf; Author: CERN DEM JLC; CreateDate: 03.12.2007; LatestRevisionDate: 17.10.2012
R62 = R1210_30R_5%_0.5W_200PPM: Resistor - 5%; Part Description: Thick Film Chip Resistor; Manufacturer: VISHAY; Manufacturer Part Number: CRCW121030R0JNEA; Power: 0.5W; TC: ±200ppm/°C; PressFit: No; Part Number: R1210_30R_5%_0.5W_200ppm; Component Kind: Standard; Component Type: Standard; Pin Count: 2; Value: 30R; Status: None; Tolerance: ±5%; Case: 1210; Mounted: Yes; Sense: No; Socket: No; SMD: Yes; HelpURL: \\cern.ch\dfs\Applications\Altium\Datasheets\R1210_VISHAY_CRCW1210.pdf; Author: CERN DEM JMW; CreateDate: 06.08.2014; LatestRevisionDate: 06.08.2014; ComponentHeight: 0.6mm
R63 = R0402_22R_1%_0.0625W_100PPM: Resistor - 1%; Part Description: General Purpose Thick Film Chip Resistor; Manufacturer: GENERIC; Manufacturer1 Part Number: 232270672209L; TC: ±100ppm/°C; PressFit: No; Part Number: R0402_22R_1%_0.0625W_100PPM; Component Kind: Standard; Component Type: Standard; Pin Count: 2; Value: 22; Status: Not Recommended; Power: 0.0625W; Tolerance: ±1%; Manufacturer Part Number: R0402_22R_1%_0.0625W_100PPM; Case: 0402; Mounted: Yes; Sense: No; Socket: No; SMD: Yes; Manufacturer1 Example: YAGEO PHYCOMP; Manufacturer1 ComponentHeight: 0.4mm; HelpURL: \\cern.ch\dfs\Applications\Altium\Datasheets\R0402_Phycomp_RC0402.pdf; Author: CERN DEM JLC; CreateDate: 03.12.2007; LatestRevisionDate: 17.10.2012
R64 = R1210_49R9_1%_0.5W_100PPM_VISHAY_CRCW: Resistor - 1%; Part Description: Thick Film Chip Resistor; Manufacturer: VISHAY DRALORIC; Manufacturer Part Number: CRCW121049R9FKTA; Power: 0.5W; TC: ±100ppm/°C; Part Number: R1210_49R9_1%_0.5W_100PPM_VISHAY_CRCW; Component Kind: Standard; Component Type: Standard; Pin Count: 2; Value: 49R9; Status: None; Tolerance: ±1%; Case: 1210; Mounted: Yes; Sense: No; Socket: No; SMD: Yes; ComponentHeight: 0.6mm; HelpURL: \\cern.ch\dfs\Applications\Altium\Datasheets\R1210_VISHAY_CRCW1210.pdf; Author: CERN DEM JMW; CreateDate: 06.08.2014; LatestRevisionDate: 06.08.2014
R65 = R0402_10K_1%_0.0625W_100PPM: Resistor - 1%; Part Description: General Purpose Thick Film Chip Resistor; Manufacturer: GENERIC; Manufacturer1 Part Number: 232270671003L; TC: ±100ppm/°C; Part Number: R0402_10K_1%_0.0625W_100PPM; Component Kind: Standard; Component Type: Standard; Pin Count: 2; Value: 10k; Status: Not recommended; Power: 0.0625W; Tolerance: ±1%; Manufacturer Part Number: R0402_10K_1%_0.0625W_100PPM; Case: 0402; Mounted: Yes; Sense: No; Socket: No; SMD: Yes; Manufacturer1 Example: YAGEO PHYCOMP; Manufacturer1 ComponentHeight: 0.4mm; HelpURL: \\cern.ch\dfs\Applications\Altium\Datasheets\R0402_Phycomp_RC0402.pdf; Author: CERN DEM JLC; CreateDate: 03.12.2007; LatestRevisionDate: 17.10.2012
R66 R69 = R0402_1K_1%_0.0625W_100PPM: Resistor - 1%; Part Description: General Purpose Thick Film Chip Resistor; Manufacturer: GENERIC; Manufacturer1 Part Number: 232270671002L; TC: ±100ppm/°C; PressFit: No; Part Number: R0402_1K_1%_0.0625W_100PPM; Component Kind: Standard; Component Type: Standard; Pin Count: 2; Value: 1k; Status: Not Recommended; Power: 0.0625W; Tolerance: ±1%; Manufacturer Part Number: R0402_1K_1%_0.0625W_100PPM; Case: 0402; Mounted: Yes; Sense: No; Socket: No; SMD: Yes; Manufacturer1 Example: YAGEO PHYCOMP; Manufacturer1 ComponentHeight: 0.4mm; HelpURL: \\cern.ch\dfs\Applications\Altium\Datasheets\R0402_Phycomp_RC0402.pdf; Author: CERN DEM JLC; CreateDate: 03.12.2007; LatestRevisionDate: 17.10.2012
T5 = BSS138LT1G: N-CHANNEL MOSFET WITH DIODE; Part Description: 50V 200mA N-Channel Enhancement Mode Field-Effect Transistor; Manufacturer: ON SEMICONDUCTOR; PressFit: No; Bonding: No; Part Number: BSS138LT1G; Component Kind: Standard; Component Type: Standard; Device: BSS138LT1G; PackageDescription: SOT23 3-Leads, Pitch 0.95mm - Body 1.4x3mm, IPC Medium Density; Manufacturer Part Number: BSS138LT1G; Pin Count: 3; Case: SOT23-3; Mounted: Yes; Socket: No; SMD: Yes; Sense: No; ComponentHeight: 1.11mm; HelpURL: \\cern.ch\dfs\Applications\Altium\Datasheets\BSS138LT1G.pdf; Author: CERN DEM JLC; CreateDate: 23.03.2009; LatestRevisionDate: 23.03.2009

## Nets that join several sheets
GND: MCX_Isolated_Mezzanine (32 pins), U_Channel1 (6 pins), U_Channel2 (6 pins), U_Channel3 (6 pins), U_Channel4 (6 pins), U_Channel5 (6 pins), U_Channel6 (6 pins), U_Channel7 (6 pins), U_Channel8 (6 pins)
P3V3: MCX_Isolated_Mezzanine (11 pins), U_Channel1 (C33A.2 IC15A.1 IC15A.7), U_Channel2 (C33B.2 IC15B.1 IC15B.7), U_Channel3 (C33C.2 IC15C.1 IC15C.7), U_Channel4 (C33D.2 IC15D.1 IC15D.7), U_Channel5 (C33E.2 IC15E.1 IC15E.7), U_Channel6 (C33F.2 IC15F.1 IC15F.7), U_Channel7 (C33G.2 IC15G.1 IC15G.7), U_Channel8 (C33H.2 IC15H.1 IC15H.7)
P5V0: MCX_Isolated_Mezzanine (B3.1 J8.1 J8.2), U_Channel1 (C3A.2 C4A.2 IC18A.2), U_Channel2 (C3B.2 C4B.2 IC18B.2), U_Channel3 (C3C.2 C4C.2 IC18C.2), U_Channel4 (C3D.2 C4D.2 IC18D.2), U_Channel5 (C3E.2 C4E.2 IC18E.2), U_Channel6 (C3F.2 C4F.2 IC18F.2), U_Channel7 (C3G.2 C4G.2 IC18G.2), U_Channel8 (C3H.2 C4H.2 IC18H.2)
DIR: MCX_Isolated_Mezzanine (IC1.1 SW4.4), U_Channel8 (IC15H.4)
DIR: MCX_Isolated_Mezzanine (IC1.3 SW4.3), U_Channel7 (IC15G.4)
DIR: MCX_Isolated_Mezzanine (IC1.5 SW4.2), U_Channel6 (IC15F.4)
DIR: MCX_Isolated_Mezzanine (IC1.7 SW4.1), U_Channel5 (IC15E.4)
DIR: MCX_Isolated_Mezzanine (IC1.22 SW2.1), U_Channel1 (IC15A.4)
DIR: MCX_Isolated_Mezzanine (IC1.24 SW2.2), U_Channel2 (IC15B.4)
DIR: MCX_Isolated_Mezzanine (IC1.26 SW2.3), U_Channel3 (IC15C.4)
DIR: MCX_Isolated_Mezzanine (IC1.28 SW2.4), U_Channel4 (IC15D.4)
GND_ISO: MCX_Isolated_Mezzanine (J1.2), U_Channel1 (19 pins)
GND_ISO: MCX_Isolated_Mezzanine (J3.2), U_Channel2 (19 pins)
GND_ISO: MCX_Isolated_Mezzanine (J5.2), U_Channel3 (19 pins)
GND_ISO: MCX_Isolated_Mezzanine (J7.2), U_Channel4 (19 pins)
GND_ISO: MCX_Isolated_Mezzanine (J9.2), U_Channel5 (19 pins)
GND_ISO: MCX_Isolated_Mezzanine (J11.2), U_Channel6 (19 pins)
GND_ISO: MCX_Isolated_Mezzanine (J13.2), U_Channel7 (19 pins)
GND_ISO: MCX_Isolated_Mezzanine (J15.2), U_Channel8 (19 pins)
IO: MCX_Isolated_Mezzanine (J8.15), U_Channel8 (R1H.2)
IO: MCX_Isolated_Mezzanine (J8.18), U_Channel7 (R1G.2)
IO: MCX_Isolated_Mezzanine (J8.19), U_Channel6 (R1F.2)
IO: MCX_Isolated_Mezzanine (J8.22), U_Channel5 (R1E.2)
IO: MCX_Isolated_Mezzanine (J8.23), U_Channel4 (R1D.2)
IO: MCX_Isolated_Mezzanine (J8.26), U_Channel3 (R1C.2)
IO: MCX_Isolated_Mezzanine (J8.27), U_Channel2 (R1B.2)
IO: MCX_Isolated_Mezzanine (J8.30), U_Channel1 (R1A.2)
IO_CON: MCX_Isolated_Mezzanine (J1.1), U_Channel1 (R62A.1 R64A.2)
IO_CON: MCX_Isolated_Mezzanine (J3.1), U_Channel2 (R62B.1 R64B.2)
IO_CON: MCX_Isolated_Mezzanine (J5.1), U_Channel3 (R62C.1 R64C.2)
IO_CON: MCX_Isolated_Mezzanine (J7.1), U_Channel4 (R62D.1 R64D.2)
IO_CON: MCX_Isolated_Mezzanine (J9.1), U_Channel5 (R62E.1 R64E.2)
IO_CON: MCX_Isolated_Mezzanine (J11.1), U_Channel6 (R62F.1 R64F.2)
IO_CON: MCX_Isolated_Mezzanine (J13.1), U_Channel7 (R62G.1 R64G.2)
IO_CON: MCX_Isolated_Mezzanine (J15.1), U_Channel8 (R62H.1 R64H.2)
TERM: MCX_Isolated_Mezzanine (IC1.2 SW3.4), U_Channel8 (IC15H.3)
TERM: MCX_Isolated_Mezzanine (IC1.4 SW3.3), U_Channel7 (IC15G.3)
TERM: MCX_Isolated_Mezzanine (IC1.6 SW3.2), U_Channel6 (IC15F.3)
TERM: MCX_Isolated_Mezzanine (IC1.8 SW3.1), U_Channel5 (IC15E.3)
TERM: MCX_Isolated_Mezzanine (IC1.21 SW1.1), U_Channel1 (IC15A.3)
TERM: MCX_Isolated_Mezzanine (IC1.23 SW1.2), U_Channel2 (IC15B.3)
TERM: MCX_Isolated_Mezzanine (IC1.25 SW1.3), U_Channel3 (IC15C.3)
TERM: MCX_Isolated_Mezzanine (IC1.27 SW1.4), U_Channel4 (IC15D.3)

## Assembly variants
Default: not fitted C4A C4B C4C C4D C4E C4F C4G C4H C5A C5B C5C C5D C5E C5F C5G C5H